# EAGLE design maus (EAGLE 9.6.2)

## Sheet 1 of 6
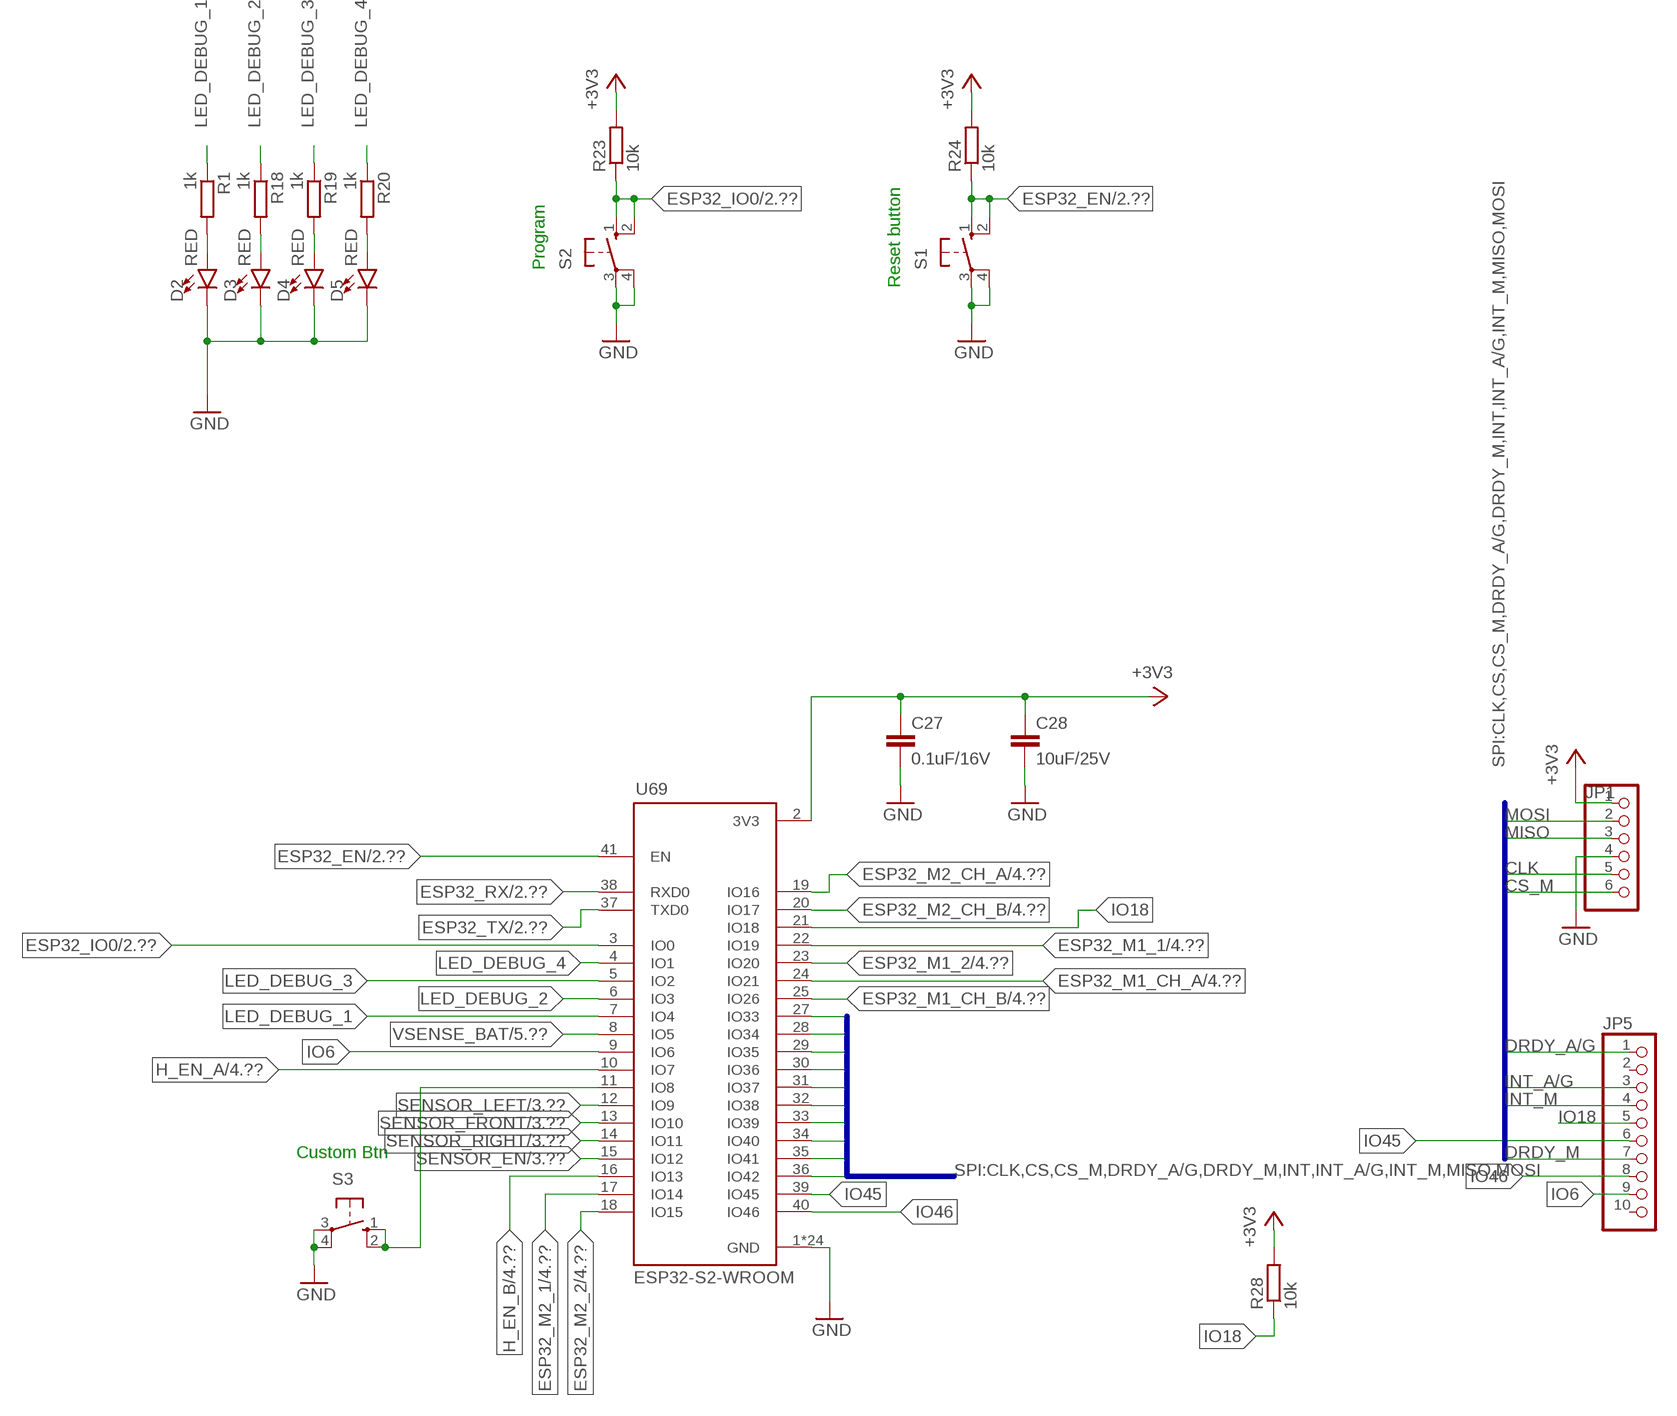
[diagram p0: schematic, sheet 1]

### Parts
C27  0.1uF/16V  C-EUC0805  [C0805]
C28  10uF/25V  C-EUC0805  [C0805]
D2  RED  LED-RED1206  [LED-1206]
D3  RED  LED-RED1206  [LED-1206]
D4  RED  LED-RED1206  [LED-1206]
D5  RED  LED-RED1206  [LED-1206]
JP1  PINHD-1X6  [1X06]
JP5  PINHD-1X10  [1X10]
R1  1k  R-EU_R0805  [R0805]
R18  1k  R-EU_R0805  [R0805]
R19  1k  R-EU_R0805  [R0805]
R20  1k  R-EU_R0805  [R0805]
R23  10k  R-EU_R0805  [R0805]
R24  10k  R-EU_R0805  [R0805]
R28  10k  R-EU_R0805  [R0805]
S1  10-XX  [B3F-10XX]
S2  10-XX  [B3F-10XX]
S3  10-XX  [B3F-10XX]
U69  ESP32-S2-WROOM  [XCVR_ESP32-S2-WROOM]

### Nets
+3V3 [power]: C27.1 C28.1 JP1.1 R23.2 R24.2 R28.2 U69.2(3V3) ; also sheet 2,4,5,6
CLK: JP1.5 U69.30(IO36) ; also sheet 6
CS: U69.28(IO34) ; also sheet 6
CS_M: JP1.6 U69.27(IO33)
DRDY_A/G: JP5.1 U69.36(IO42)
DRDY_M: JP5.7 U69.32(IO38)
ESP32_EN: R24.1 S1.1(S) S1.2(S1) U69.41(EN) ; also sheet 2
ESP32_IO0: R23.1 S2.1(S) S2.2(S1) U69.3(IO0) ; also sheet 2
ESP32_M1_1: U69.22(IO19) ; also sheet 4
ESP32_M1_2: U69.23(IO20) ; also sheet 4
ESP32_M1_CH_A: U69.24(IO21) ; also sheet 4
ESP32_M1_CH_B: U69.25(IO26) ; also sheet 4
ESP32_M2_1: U69.17(IO14) ; also sheet 4
ESP32_M2_2: U69.18(IO15) ; also sheet 4
ESP32_M2_CH_A: U69.19(IO16) ; also sheet 4
ESP32_M2_CH_B: U69.20(IO17) ; also sheet 4
ESP32_RX: U69.38(RXD0) ; also sheet 2
ESP32_TX: U69.37(TXD0) ; also sheet 2
GND [power]: C27.2 C28.2 D2.C D3.C D4.C D5.C JP1.4 S1.3(P) S1.4(P1) S2.3(P) S2.4(P1) S3.3(P) S3.4(P1) U69.1(GND) U69.26(GND) U69.42(GND) U69.43.1(GND) U69.43.2(GND) U69.43.3(GND) U69.43.4(GND) U69.43.5(GND) U69.43.6(GND) U69.43.7(GND) U69.43.8(GND) U69.43.9(GND) U69.43.10(GND) U69.43.11(GND) U69.43.12(GND) U69.43.13(GND) U69.43.14(GND) U69.43.15(GND) U69.43.16(GND) U69.43.17(GND) U69.43.18(GND) U69.43.19(GND) U69.43.20(GND) U69.43.21(GND) ; also sheet 2,3,4,5,6
H_EN_A: U69.10(IO7) ; also sheet 4
H_EN_B: U69.16(IO13) ; also sheet 4
INT: U69.33(IO39) ; also sheet 6
INT_A/G: JP5.3 U69.35(IO41)
INT_M: JP5.4 U69.34(IO40)
IO6: JP5.9 U69.9(IO6)
IO18: JP5.5 R28.1 U69.21(IO18)
IO45: JP5.6 U69.39(IO45)
IO46: JP5.8 U69.40(IO46)
LED_DEBUG_1: R1.1 U69.7(IO4)
LED_DEBUG_2: R18.1 U69.6(IO3)
LED_DEBUG_3: R19.1 U69.5(IO2)
LED_DEBUG_4: R20.1 U69.4(IO1)
MISO: JP1.3 U69.31(IO37) ; also sheet 6
MOSI: JP1.2 U69.29(IO35) ; also sheet 6
N$1: S3.1(S) S3.2(S1) U69.11(IO8)
N$23: D2.A R1.2
N$25: D3.A R18.2
N$26: D4.A R19.2
N$28: D5.A R20.2
SENSOR_EN: U69.15(IO12) ; also sheet 3
SENSOR_FRONT: U69.13(IO10) ; also sheet 3
SENSOR_LEFT: U69.12(IO9) ; also sheet 3
SENSOR_RIGHT: U69.14(IO11) ; also sheet 3
VSENSE_BAT: U69.8(IO5) ; also sheet 5
Unconnected: JP5.2 JP5.10

### Buses
SPI:CLK,CS,CS_M,DRDY_A/G,DRDY_M,INT,INT_A/G,INT_M,MISO,MOSI

### Notes on the sheet
- Program
- Reset button
- Custom Btn

## Sheet 2 of 6: UART/Prog
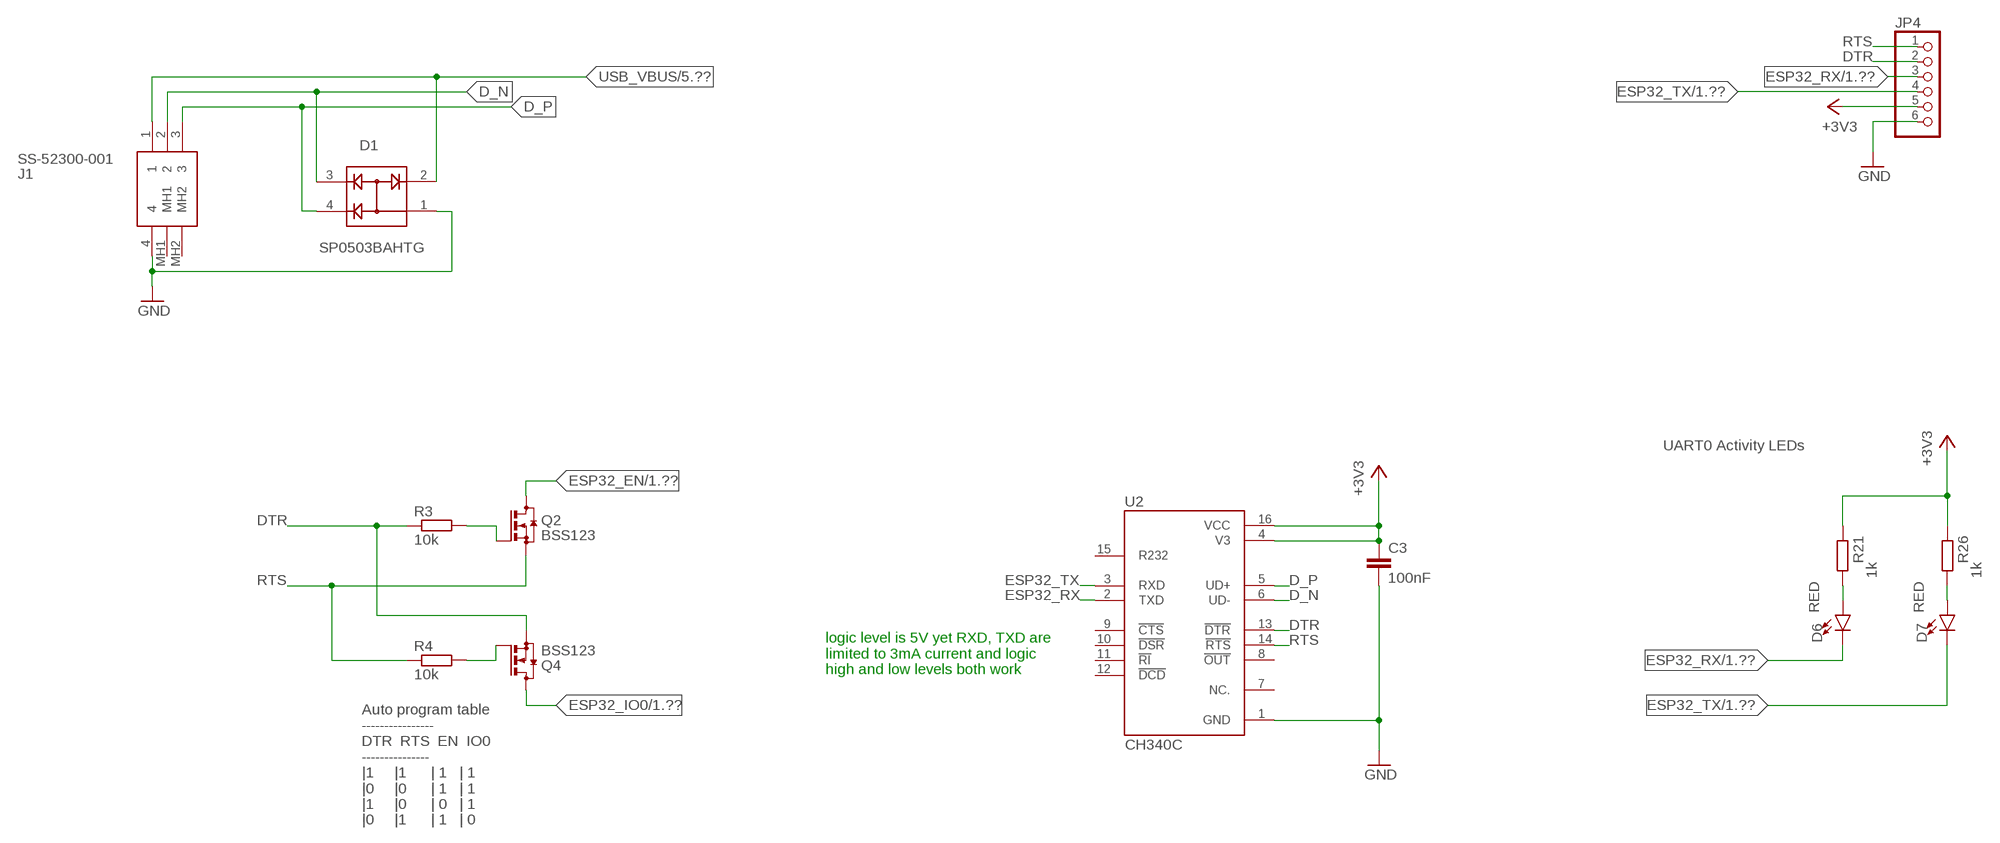
[diagram p1: schematic, sheet 2]

### Parts
C3  100nF  C-EUC0805  [C0805]
D1  SP0503BAHTG  [SOT143]
D6  RED  LED-RED1206  [LED-1206]
D7  RED  LED-RED1206  [LED-1206]
J1  SS-52300-001  [SS52300001]
JP4  PINHD-1X6  [1X06]
Q2  BSS123  [SOT23]
Q4  BSS123  [SOT23]
R3  10k  R-EU_R0805  [R0805]
R4  10k  R-EU_R0805  [R0805]
R21  1k  R-EU_R0805  [R0805]
R26  1k  R-EU_R0805  [R0805]
U2  CH340C  [SOIC127P600X180-16N]

### Nets
+3V3 [power]: C3.1 JP4.5 R21.2 R26.2 U2.4(V3) U2.16(VCC) ; also sheet 1,4,5,6
D_N: D1.3 J1.2 U2.6(UD-)
D_P: D1.4 J1.3 U2.5(UD+)
DTR: JP4.2 Q4.2(S) R3.1 U2.13(!DTR)
ESP32_EN: Q2.3(D) ; also sheet 1
ESP32_IO0: Q4.3(D) ; also sheet 1
ESP32_RX: D6.C JP4.3 U2.2(TXD) ; also sheet 1
ESP32_TX: D7.C JP4.4 U2.3(RXD) ; also sheet 1
GND [power]: C3.2 D1.1 J1.4 JP4.6 U2.1(GND) ; also sheet 1,3,4,5,6
N$5: Q2.1(G) R3.2
N$6: Q4.1(G) R4.2
N$8: D6.A R21.1
N$22: D7.A R26.1
RTS: JP4.1 Q2.2(S) R4.1 U2.14(!RTS)
USB_VBUS: D1.2 J1.1 ; also sheet 5
Unconnected: J1.MH1 J1.MH2 U2.7(NC.) U2.8(!OUT) U2.9(!CTS) U2.10(!DSR) U2.11(!RI) U2.12(!DCD) U2.15(R232)

### Notes on the sheet
- UART0 Activity LEDs
- logic level is 5V yet RXD, TXD are 
  limited to 3mA current and logic
  high and low levels both work
- Auto program table
  ----------------
  DTR  RTS  EN  IO0
  ---------------
  |1     |1      | 1   | 1
  |0     |0      | 1   | 1
  |1     |0      | 0   | 1
  |0     |1      | 1   | 0

## Sheet 3 of 6: IR
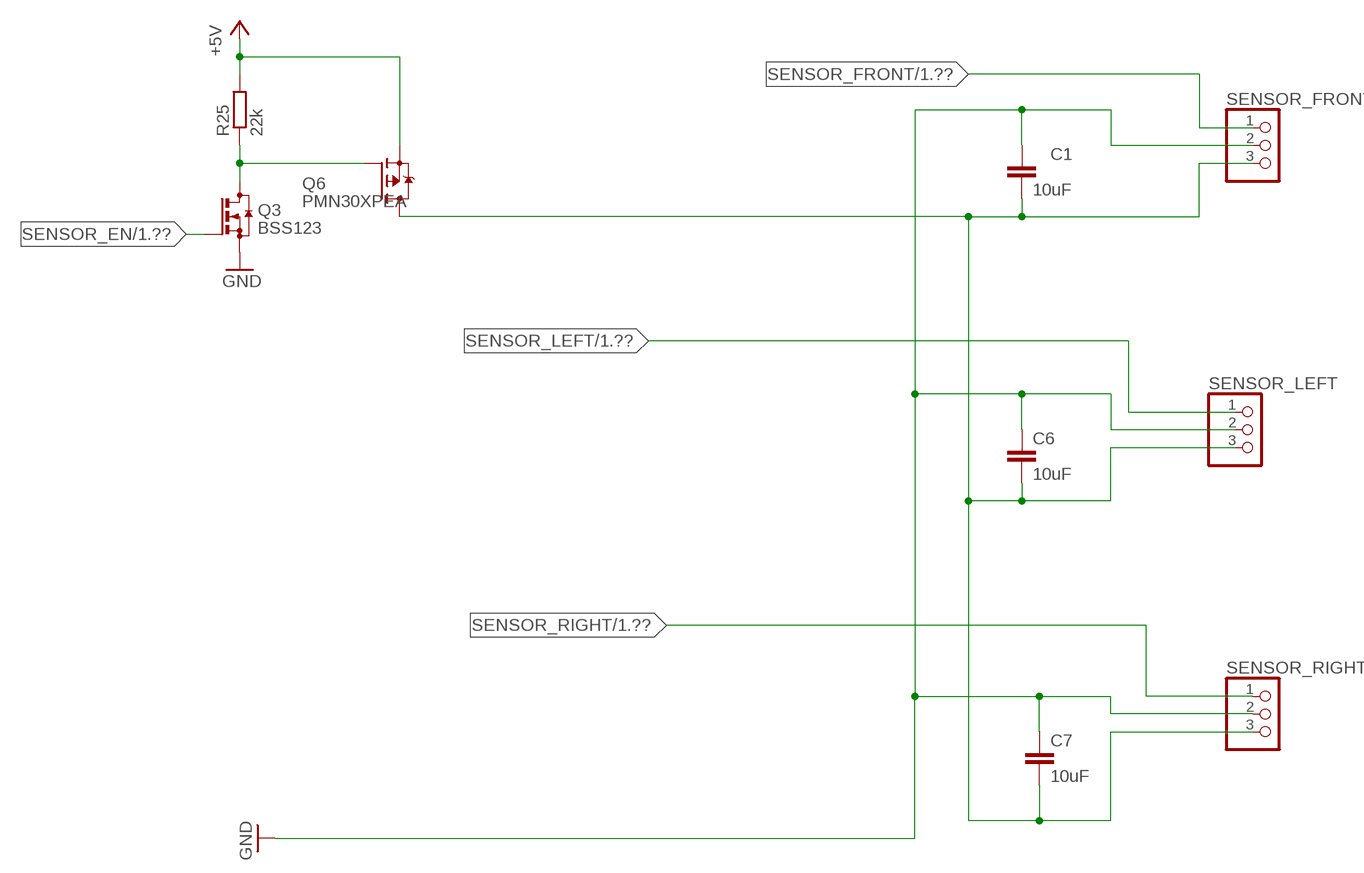
[diagram p2: schematic, sheet 3]

### Parts
C1  10uF  C-EUC0805  [C0805]
C6  10uF  C-EUC0805  [C0805]
C7  10uF  C-EUC0805  [C0805]
Q3  BSS123  [SOT23]
Q6  PMN30XPEA  [SOT95P255X110-6N]
R25  22k  R-EU_R0805  [R0805]
SENSOR_FRONT  PINHD-1X3  [1X03]
SENSOR_LEFT  PINHD-1X3  [1X03]
SENSOR_RIGHT  PINHD-1X3  [1X03]

### Nets
+5V [power]: Q6.4(S) R25.2 ; also sheet 4,5
GND [power]: C1.1 C6.1 C7.1 Q3.2(S) SENSOR_FRONT.2 SENSOR_LEFT.2 SENSOR_RIGHT.2 ; also sheet 1,2,4,5,6
N$2: Q3.3(D) Q6.3(G) R25.1
N$7: C1.2 C6.2 C7.2 Q6.1(D) Q6.2(D) Q6.5(D) Q6.6(D) SENSOR_FRONT.3 SENSOR_LEFT.3 SENSOR_RIGHT.3
SENSOR_EN: Q3.1(G) ; also sheet 1
SENSOR_FRONT: SENSOR_FRONT.1 ; also sheet 1
SENSOR_LEFT: SENSOR_LEFT.1 ; also sheet 1
SENSOR_RIGHT: SENSOR_RIGHT.1 ; also sheet 1

## Sheet 4 of 6: H-bridge motor driver
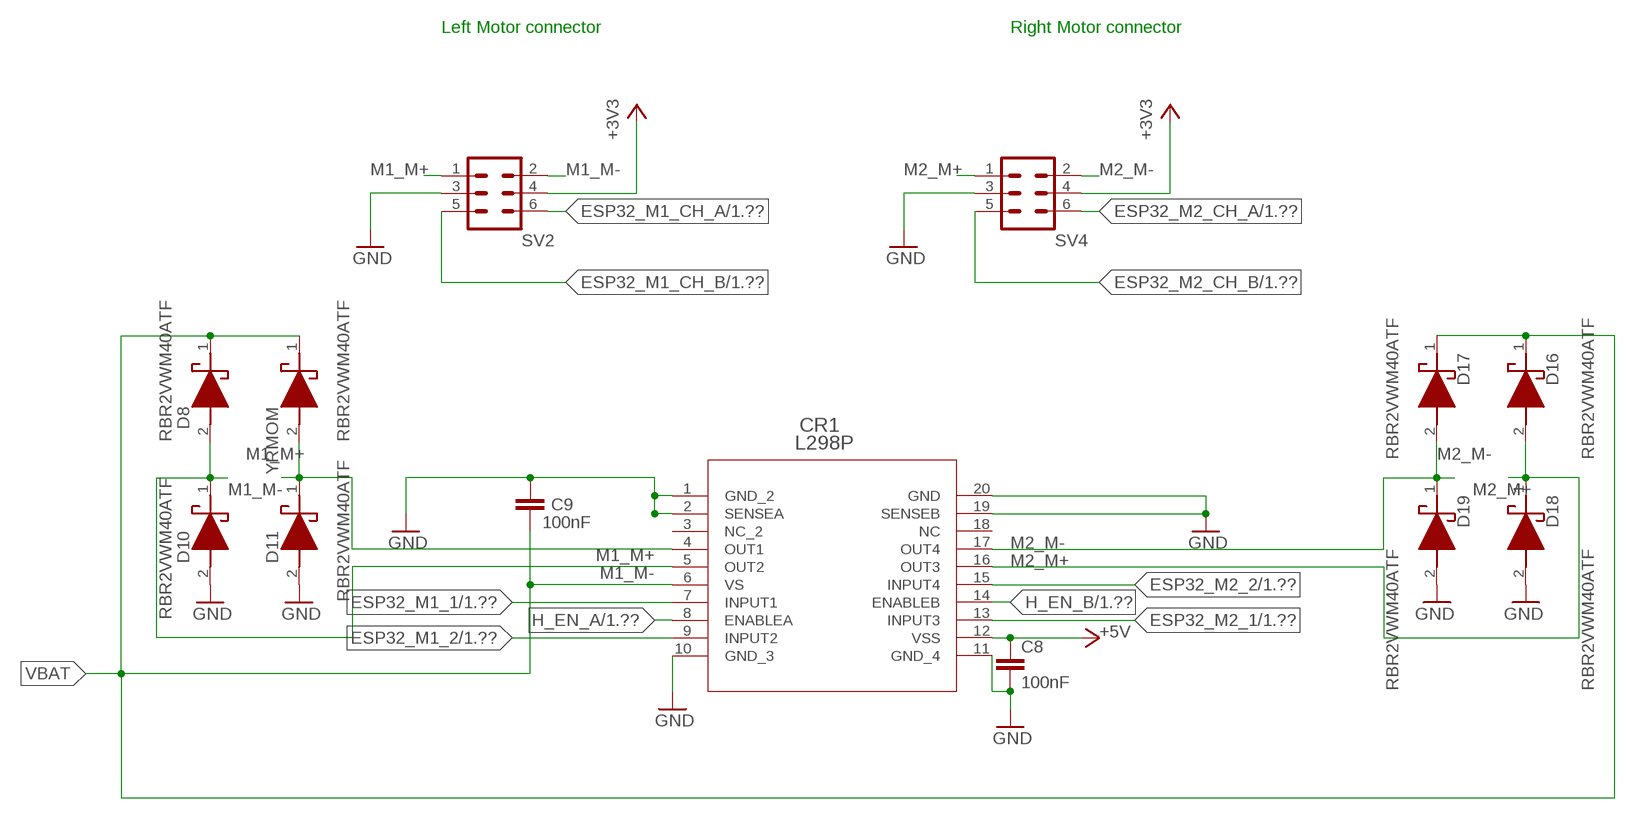
[diagram p3: schematic, sheet 4]

### Parts
C8  100nF  C-EUC0805  [C0805]
C9  100nF  C-EUC0805  [C0805]
CR1  L298P  [POWERSO-20_STM]
D8  RBR2VWM40ATF  [RB068VWM100]
D10  RBR2VWM40ATF  [RB068VWM100]
D11  RBR2VWM40ATF  [RB068VWM100]
D16  RBR2VWM40ATF  [RB068VWM100]
D17  RBR2VWM40ATF  [RB068VWM100]
D18  RBR2VWM40ATF  [RB068VWM100]
D19  RBR2VWM40ATF  [RB068VWM100]
SV2  ML6  [ML6]
SV4  ML6  [ML6]
YRMOM  RBR2VWM40ATF  [RB068VWM100]

### Nets
+3V3 [power]: SV2.4 SV4.4 ; also sheet 1,2,5,6
+5V [power]: C8.1 CR1.12(VSS) ; also sheet 3,5
ESP32_M1_1: CR1.7(INPUT1) ; also sheet 1
ESP32_M1_2: CR1.9(INPUT2) ; also sheet 1
ESP32_M1_CH_A: SV2.6 ; also sheet 1
ESP32_M1_CH_B: SV2.5 ; also sheet 1
ESP32_M2_1: CR1.13(INPUT3) ; also sheet 1
ESP32_M2_2: CR1.15(INPUT4) ; also sheet 1
ESP32_M2_CH_A: SV4.6 ; also sheet 1
ESP32_M2_CH_B: SV4.5 ; also sheet 1
GND [power]: C8.2 C9.2 CR1.1(GND_2) CR1.2(SENSEA) CR1.10(GND_3) CR1.11(GND_4) CR1.19(SENSEB) CR1.20(GND) D10.2(A) D11.2(A) D18.2(A) D19.2(A) SV2.3 SV4.3 ; also sheet 1,2,3,5,6
H_EN_A: CR1.8(ENABLEA) ; also sheet 1
H_EN_B: CR1.14(ENABLEB) ; also sheet 1
M1_M+ [motorpower]: CR1.4(OUT1) D11.1(K) SV2.1 YRMOM.2(A)
M1_M- [motorpower]: CR1.5(OUT2) D8.2(A) D10.1(K) SV2.2
M2_M+ [motorpower]: CR1.16(OUT3) D16.2(A) D18.1(K) SV4.1
M2_M- [motorpower]: CR1.17(OUT4) D17.2(A) D19.1(K) SV4.2
VBAT [power]: C9.1 CR1.6(VS) D8.1(K) D16.1(K) D17.1(K) YRMOM.1(K) ; also sheet 5
Unconnected: CR1.3(NC_2) CR1.18(NC)

### Notes on the sheet
- Left Motor connector | Right Motor connector

## Sheet 5 of 6: power
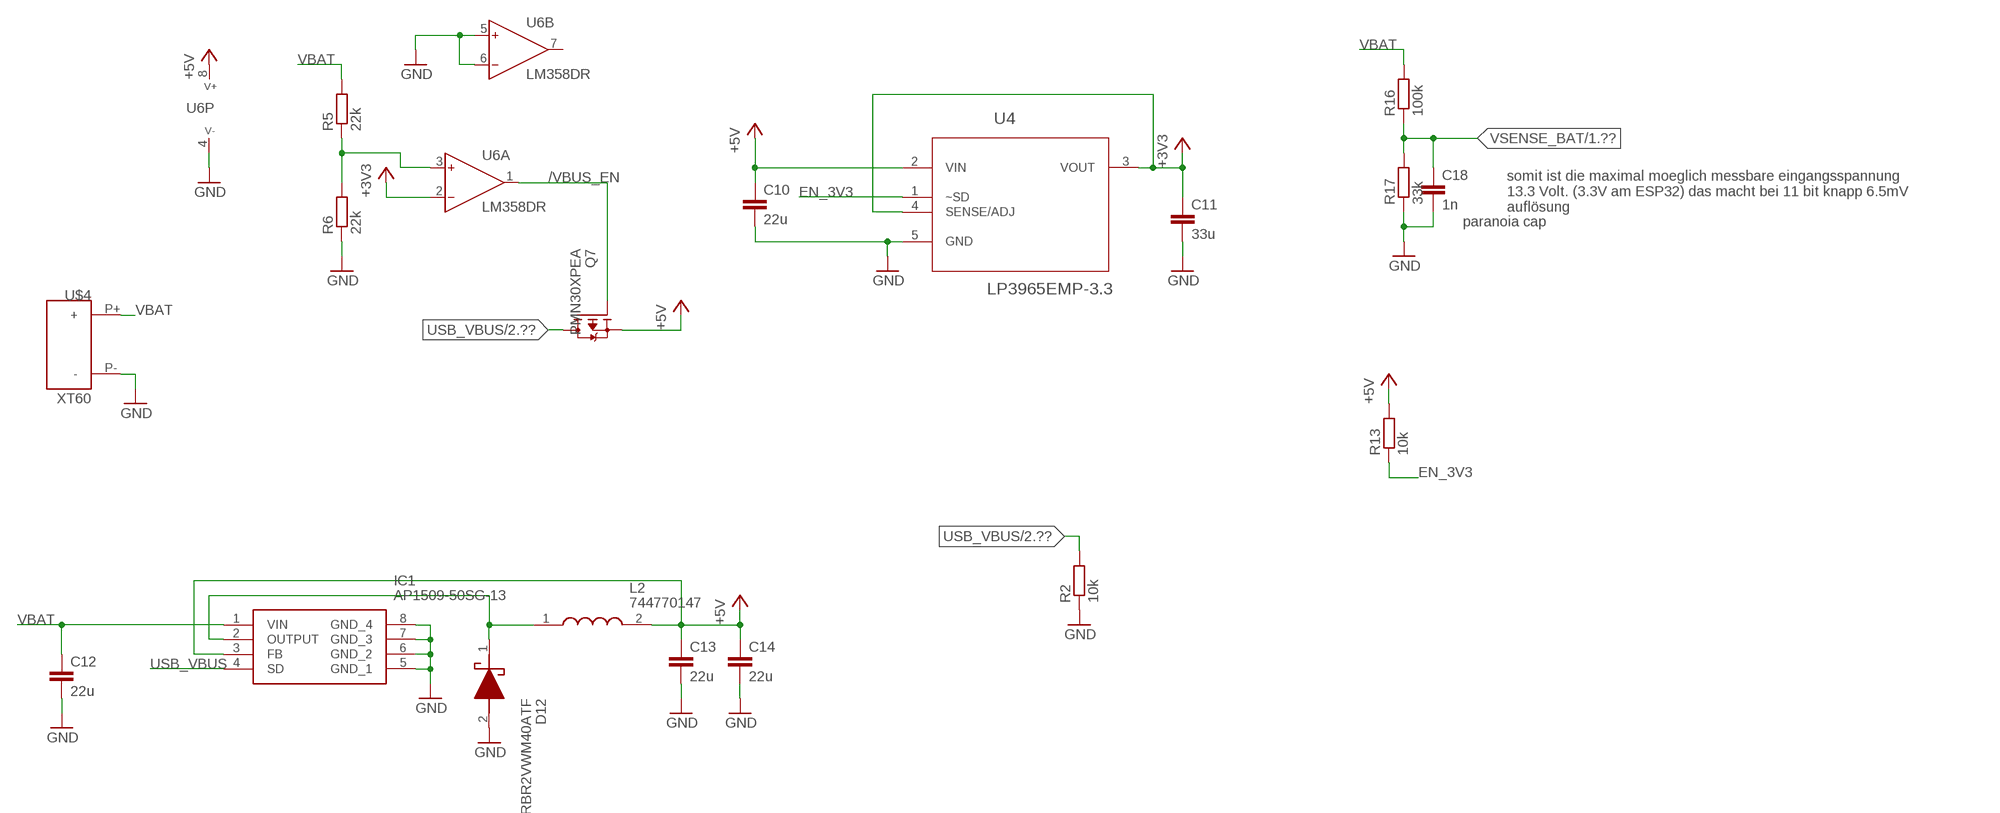
[diagram p4: schematic, sheet 5]

### Parts
C10  22u  C-EUC0805  [C0805]
C11  33u  C-EUC0805  [C0805]
C12  22u  C-EUC0805  [C0805]
C13  22u  C-EUC0805  [C0805]
C14  22u  C-EUC0805  [C0805]
C18  1n  C-EUC0805  [C0805]
D12  RBR2VWM40ATF  [RB068VWM100]
IC1  AP1509-50SG-13  [SOIC127P600X175-8N]
L2  744770147  [WE-PD_1260/1245/1280/121054]
Q7  PMN30XPEA  [SOT95P255X110-6N]
R2  10k  R-EU_R0805  [R0805]
R5  22k  R-EU_R0805  [R0805]
R6  22k  R-EU_R0805  [R0805]
R13  10k  R-EU_R0805  [R0805]
R16  100k  R-EU_R0805  [R0805]
R17  33k  R-EU_R0805  [R0805]
U4  LP3965EMP-3.3  [SOT150P696X180-5N]
U6  LM358DR  [SOIC127P610X175-8N]
U$4  XT60  [XT60-UPRIGHT]

### Nets
+3V3 [power]: C11.1 U4.3(VOUT) U4.4(SENSE/ADJ) U6.2(A:IN-) ; also sheet 1,2,4,6
+5V [power]: C10.1 C13.1 C14.1 IC1.3(FB) L2.2 Q7.4(S) R13.2 U4.2(VIN) U6.8(P:V+) ; also sheet 3,4
/VBUS_EN: Q7.3(G) U6.1(A:OUT)
EN_3V3: R13.1 U4.1(~SD)
GND [power]: C10.2 C11.2 C12.2 C13.2 C14.2 C18.2 D12.2(A) IC1.5(GND_1) IC1.6(GND_2) IC1.7(GND_3) IC1.8(GND_4) R2.1 R6.1 R17.1 U4.5(GND) U6.4(P:V-) U6.5(B:IN+) U6.6(B:IN-) U$4.P-(-) ; also sheet 1,2,3,4,6
N$3: D12.1(K) IC1.2(OUTPUT) L2.1
N$13: R5.1 R6.2 U6.3(A:IN+)
USB_VBUS: IC1.4(SD) Q7.1(D) Q7.2(D) Q7.5(D) Q7.6(D) R2.2 ; also sheet 2
VBAT [power]: C12.1 IC1.1(VIN) R5.2 R16.2 U$4.P+(+) ; also sheet 4
VSENSE_BAT: C18.1 R16.1 R17.2 ; also sheet 1
Unconnected: U6.7(B:OUT)

### Notes on the sheet
- somit ist die maximal moeglich messbare eingangsspannung
  13.3 Volt. (3.3V am ESP32) das macht bei 11 bit knapp 6.5mV
  auflösung
- paranoia cap

## Sheet 6 of 6: navigation
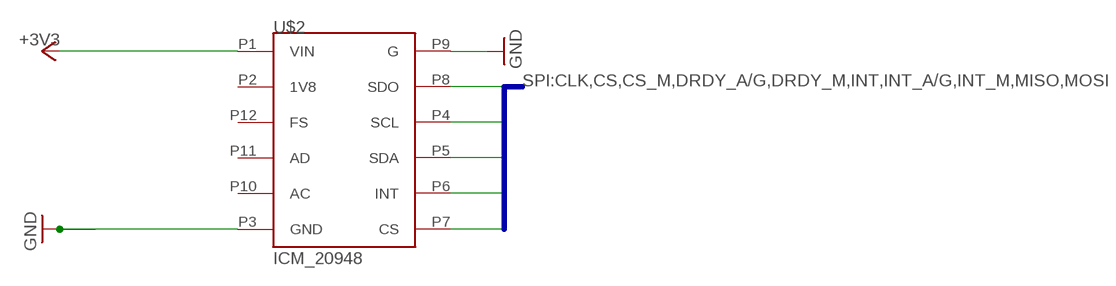
[diagram p5: schematic, sheet 6]

### Parts
U$2  ICM_20948  [ICM_20948-F]

### Nets
+3V3 [power]: U$2.P1(VIN) ; also sheet 1,2,4,5
CLK: U$2.P4(SCL) ; also sheet 1
CS: U$2.P7(CS) ; also sheet 1
GND [power]: U$2.P3(GND) U$2.P9(G) ; also sheet 1,2,3,4,5
INT: U$2.P6(INT) ; also sheet 1
MISO: U$2.P8(SDO) ; also sheet 1
MOSI: U$2.P5(SDA) ; also sheet 1
Unconnected: U$2.P2(1V8) U$2.P10(AC) U$2.P11(AD) U$2.P12(FS)

### Buses
SPI:CLK,CS,CS_M,DRDY_A/G,DRDY_M,INT,INT_A/G,INT_M,MISO,MOSI

## Library data of the parts
C1 C3 C6-C14 C18 C27 C28 = rcl:C-EU: CAPACITOR, European symbol; SPICEPREFIX: C
CR1 = maus:L298P; COPYRIGHT: Copyright (C) 2022 Ultra Librarian. All rights reserved.; MANUFACTURER_PART_NUMBER: L298P; MFR_NAME: STMicroelectronics
D1 = maus:SP0503BAHTG: TVS DIODE 5.5VWM 8.5VC SOT143 Check availability <https://pricing.snapeda.com/parts/SP0503BAHTG/Littelfuse%20Inc./view-part?ref=eda>; AVAILABILITY: In Stock; DESCRIPTION: 8.5V Clamp - Ipp Tvs Diode Surface Mount SOT-143-4; MF: Littelfuse Inc.; MP: SP0503BAHTG; PACKAGE: None; PRICE: None; PURCHASE-URL: https://pricing.snapeda.com/search/part/SP0503BAHTG/?ref=eda
D2-D7 = SparkFun-LED:LED-RED: Red SMD LED Used in manufacturing of most products at SparkFun Packages: 0603 - SMD 0603 package [Product Link] <http://docs.avagotech.com/docs/AV02-0551EN> 0603 SMART - SMD 0603 SMART package ( more efficient and expensive)[Product Link] <http://www.osram-os.com/Graphics/XPic2/00077099_0.pdf> 1206 - SMD1206 package [Product Link] <https://www.sparkfun.com/datasheets/DevTools/LilyPad/Q150OVS4.pdff> SparkFun Products: Pro Mini 328 -5V <https://www.sparkfun.com/products/821> RedBoard <https://www.sparkfun.com/products/12757> IOIO-OTG <https://www.sparkfun.com/products/13613>; PROD_ID: DIO-09912
D8 D10-D12 D16-D19 YRMOM = maus:RBR2VWM40ATF: Low VF, 40V, 2A, Schottky Barrier Diode for Automoive Source: Datasheet <https://fscdn.rohm.com/en/products/databook/datasheet/discrete/diode/schottky_barrier/rbr2vwm40atftr-e.pdf>; DESCRIPTION: Low V<sub>F</sub>, 40V, 2A, Schottky Barrier Diode for Automoive; HEIGHT: 0.95mm; MANUFACTURER_NAME: ROHM Semiconductor; MANUFACTURER_PART_NUMBER: RBR2VWM40ATF
IC1 = maus:AP1509-50SG-13: DiodesZetex, AP1509-50SG-13 DC-DC Converter 2A 8-Pin, SOP Source: Datasheet <https://www.diodes.com/assets/Datasheets/AP1509.pdf>; ARROW_PART_NUMBER: AP1509-50SG-13; ARROW_PRICE-STOCK: https://www.arrow.com/en/products/ap1509-50sg-13/diodes-incorporated?region=nac; DESCRIPTION: DiodesZetex, AP1509-50SG-13 DC-DC Converter 2A 8-Pin, SOP; HEIGHT: 1.75mm; MANUFACTURER_NAME: Diodes Inc.; MANUFACTURER_PART_NUMBER: AP1509-50SG-13; MOUSER_PART_NUMBER: 621-AP1509-50SG-13; MOUSER_PRICE-STOCK: https://www.mouser.co.uk/ProductDetail/Diodes-Incorporated/AP1509-50SG-13?qs=EJYhozv%252BYpwbI10CpTvwPw%3D%3D
J1 = maus:SS-52300-001: USB Connectors USB 2.0 RA Receptacle Type B Source: Datasheet <https://belfuse.com/resources/datasheets/stewartconnector/ds-stw-usb-2.0-type-b-connectors.pdf>; DESCRIPTION: USB Connectors USB 2.0 RA Receptacle Type B; HEIGHT: 10.82mm; MANUFACTURER_NAME: Bel; MANUFACTURER_PART_NUMBER: SS-52300-001; MOUSER_PART_NUMBER: 530-SS-52300-001
JP1 JP4 = maus:PINHD-1X6: PIN HEADER
JP5 = maus:PINHD-1X10: PIN HEADER
L2 = maus:744770147: SMD-Shielded Power Inductors WE-PD Source: Datasheet; DESCRIPTION: SMD-Shielded Power Inductors WE-PD; HEIGHT: mm; MANUFACTURER_NAME: Wurth Elektronik; MANUFACTURER_PART_NUMBER: 744770147; MOUSER_PART_NUMBER: 710-744770147; MOUSER_PRICE-STOCK: https://www.mouser.co.uk/ProductDetail/Wurth-Elektronik/744770147?qs=E%2F%2FhvbtCqpOiGvqyq%252BELzg%3D%3D
Q2-Q4 = transistor-small-signal:BSS123: N-CHANNEL MOS FET
Q6 Q7 = maus:PMN30XPEA
R1-R6 R13 R16-R21 R23-R26 R28 = rcl:R-EU_: RESISTOR, European symbol; SPICEPREFIX: R
S1-S3 = switch-omron:10-XX: OMRON SWITCH; MPN: B3F-1000; OC_FARNELL: 176432; OC_NEWARK: 36M3542
SENSOR_FRONT SENSOR_LEFT SENSOR_RIGHT = maus:PINHD-1X3: PIN HEADER
SV2 SV4 = con-harting-ml:ML6: HARTING; OC_FARNELL: unknown; OC_NEWARK: unknown
U2 = maus:CH340C: USB to serial chip CH340 Check availability <https://pricing.snapeda.com/parts/CH340C/WCH/view-part?ref=eda>; AVAILABILITY: Not in stock; DESCRIPTION: USB to serial chip CH340; MF: WCH; MP: CH340C; PACKAGE: None; PRICE: None
U4 = maus:LP3965EMP-3.3: Fast Ultra Low Dropout Linear Regulators Check availability <https://pricing.snapeda.com/parts/LP3965EMP-3.3/NOPB/Texas%20Instruments/view-part?ref=eda>; AVAILABILITY: In Stock; DESCRIPTION: 1.5-A, low-dropout voltage regulator with sense & enable 5-SOT-223 -40 to 125; MF: Texas Instruments; MP: LP3965EMP-3.3/NOPB; PACKAGE: SOT-223-5 Texas Instruments; PRICE: None; PURCHASE-URL: https://pricing.snapeda.com/search/part/LP3965EMP-3.3/NOPB/?ref=eda
U6 = maus:LM358DR: LM358DR dual op-amp
U69 = maus:ESP32-S2-WROOM: WiFi 802.11b/g/n Transceiver Module 2.4GHz PCB Trace Surface Mount Check availability <https://pricing.snapeda.com/parts/ESP32-S2-WROOM/Espressif%20Systems/view-part?ref=eda>; AVAILABILITY: In Stock; DESCRIPTION: WiFi 802.11b/g/n Transceiver Module 2.4GHz Antenna Not Included, I-PEX Surface Mount; MF: Espressif Systems; MP: ESP32-S2-WROOM; PACKAGE: VFQFN-56 Espressif Systems; PRICE: None; PURCHASE-URL: https://pricing.snapeda.com/search/part/ESP32-S2-WROOM/?ref=eda
U$2 = maus:ICM_20948: The ICM20948 from Invensense packs 9 Degrees of freedom into a teeny package, making it a one stop shop for all the DOFs you need! Within it’s svelte 3x3mm package there are not just one MEMS sensor die like your common sensors, but two sensor dies!
U$4 = maus:XT60

## Net classes
0 default: width 0.127 mm, clearance 0.254 mm
1 power: width 0.508 mm, clearance 0.254 mm
2 motorpower: width 0.508 mm

## Board
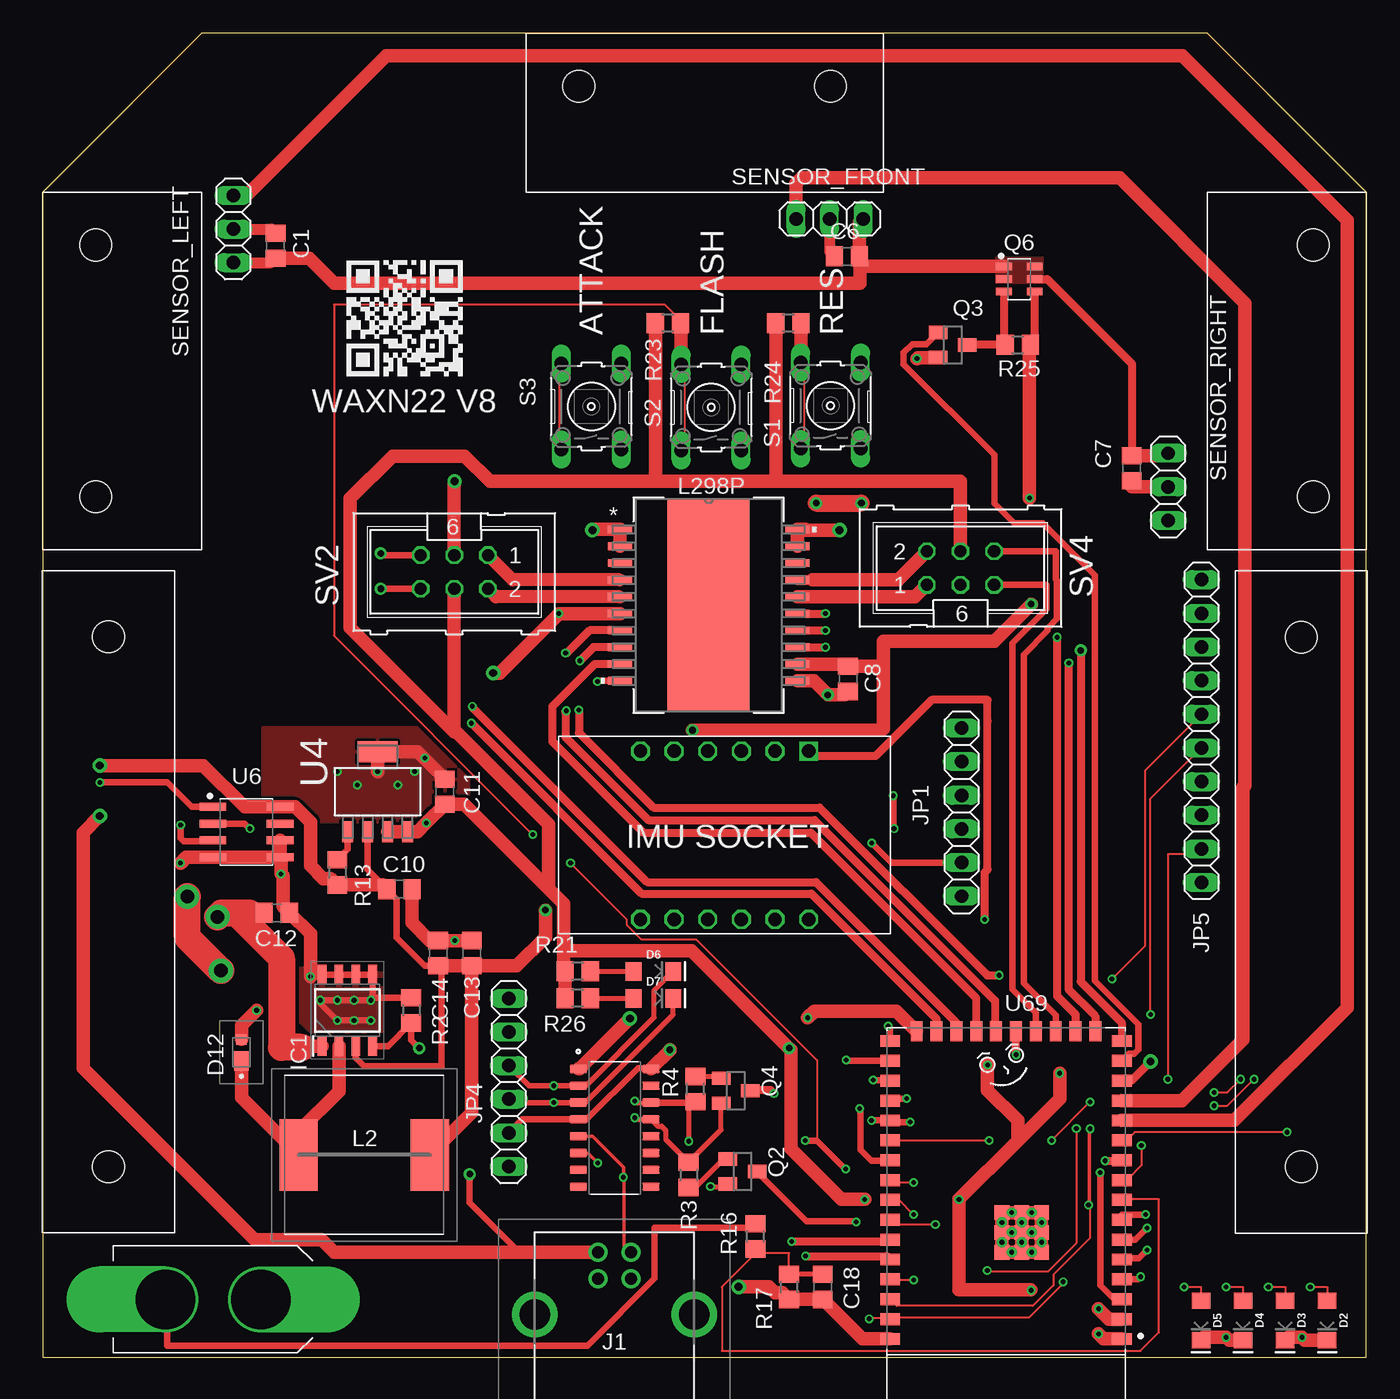
[diagram p6: board, top side]
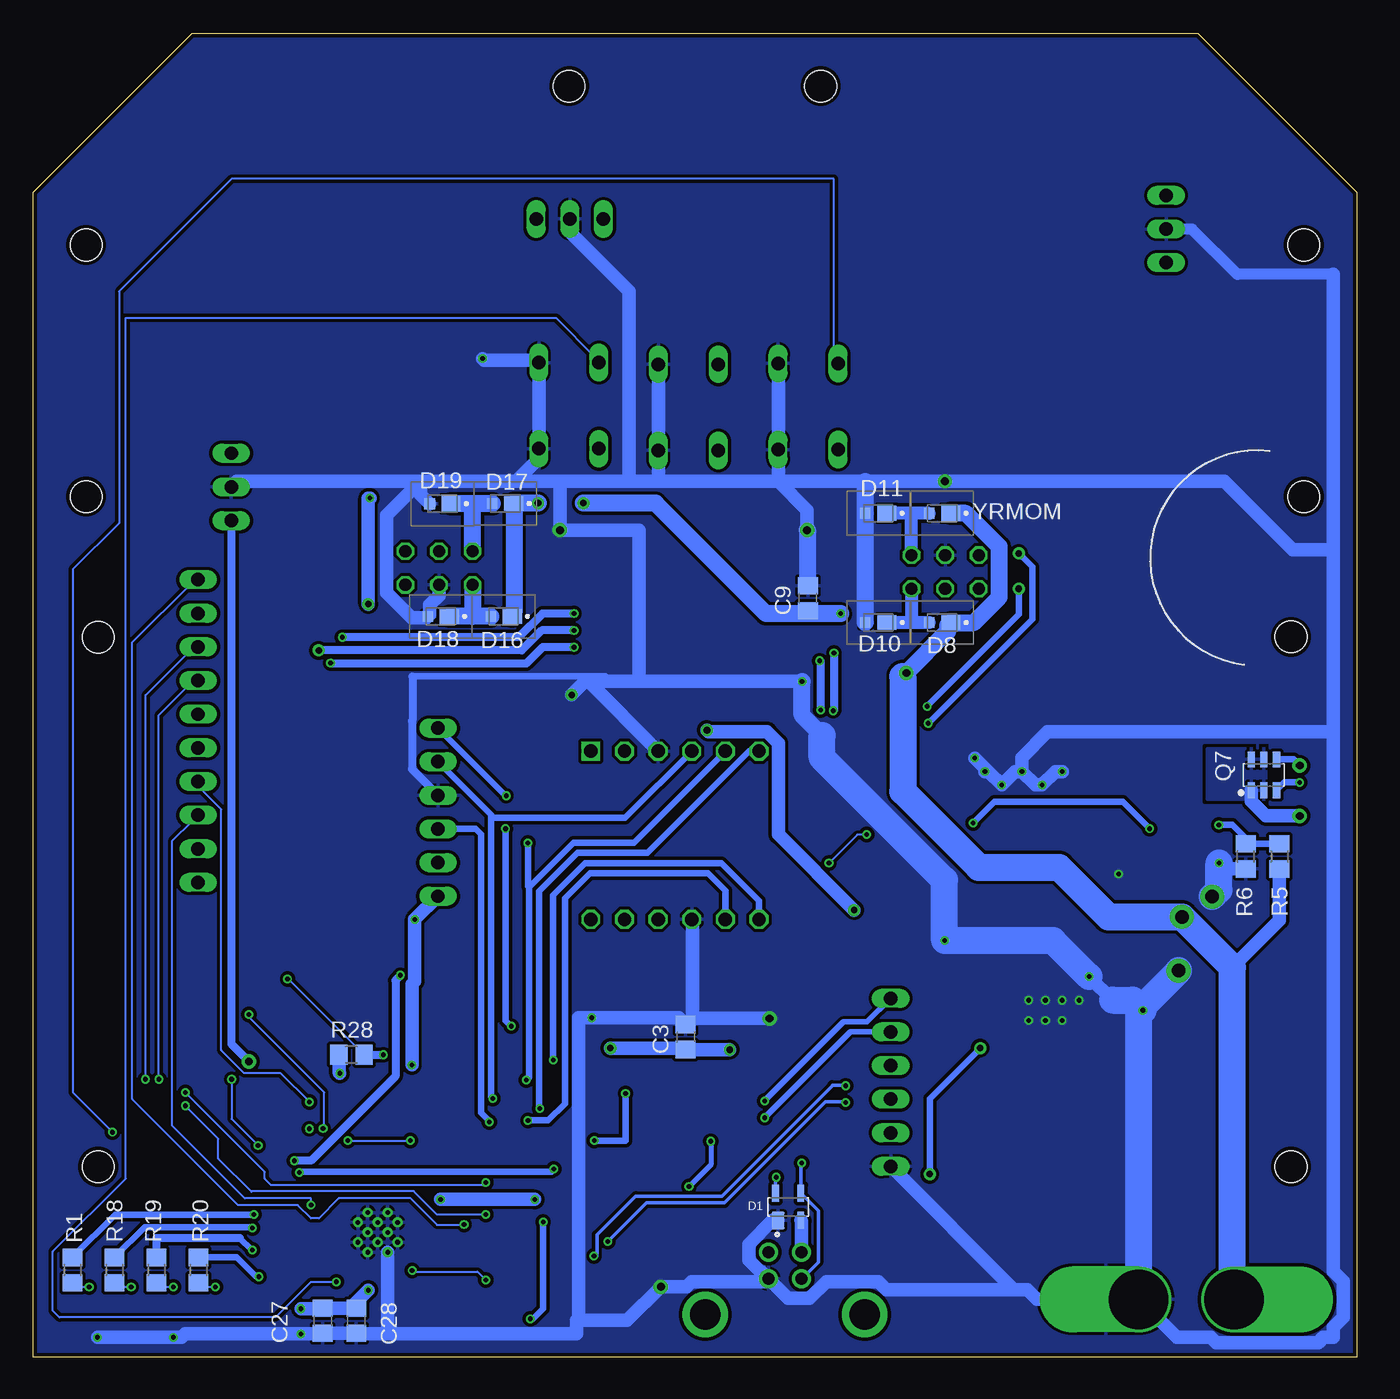
[diagram p7: board, bottom side, seen from below]

Size 100 x 100 mm. Coordinates in mm from the lower left corner, seen from the top.
Outline: 0,0 100,0 100,88 88,100 12,100 0,88 0,0
Copper layers (1*16): Top 0.035mm / dielectric 1.5mm / Bottom 0.035mm
Design rules "PCB-POOL Standard": minimum track width 0.15mm, minimum drill 0.3mm, track to track 0.15mm, track to pad 0.15mm, pad to pad 0.15mm, via to via 0.15mm, smd to smd 0.15mm, copper to edge 0.3mm, drill to drill 0.2mm, minimum pad ring 0.2mm, minimum via ring 0.15mm, stop-mask expansion 0.03mm, vias tented up to drill 0mil, thermal gap 0.2mm

### Footprints (pad centres in the part's own frame; a part is rotated, then mirrored left to right if it is on the bottom)
C0805 = smd 1.3 x 1.5: 1 -0.95,0; 2 0.95,0
POWERSO-20_STM = smd 1.803 x 0.584: 1 -6.706,5.715; 2 -6.706,4.445; 3 -6.706,3.175; 4 -6.706,1.905; 5 -6.706,0.635; 6 -6.706,-0.635; 7 -6.706,-1.905; 8 -6.706,-3.175; 9 -6.706,-4.445; 10 -6.706,-5.715; 11 6.706,-5.715; 12 6.706,-4.445; 13 6.706,-3.175; 14 6.706,-1.905; 15 6.706,-0.635; 16 6.706,0.635; 17 6.706,1.905; 18 6.706,3.175; 19 6.706,4.445; 20 6.706,5.715 | smd 6.198 x 16.002: EPAD 0,0
SOT143 = smd 0.99 x 1.3: 1 -0.76,-1.025 | smd 0.59 x 1.3: 2 0.96,-1.025; 3 0.96,1.025; 4 -0.96,1.025
LED-1206 = smd 1.2 x 1.4: A -1.5,0; C 1.5,0
RB068VWM100 = smd 1.1 x 1.45: 1 0,-0.65 | smd 0.8 x 0.8: 2 0,0.975
SOIC127P600X175-8N = smd 1.5 x 0.65: 1 -2.7,1.905; 2 -2.7,0.635; 3 -2.7,-0.635; 4 -2.7,-1.905; 5 2.7,-1.905; 6 2.7,-0.635; 7 2.7,0.635; 8 2.7,1.905
SS52300001 = drill 0.92 pad 1.431: 1 0,0; 2 0,-2; 3 2.5,0; 4 2.5,-2 | drill 2.3 pad 3.45: MH1 -4.77,-4.71; MH2 7.27,-4.71
1X06 = drill 1.016 long: 1 -6.35,0; 2 -3.81,0; 3 -1.27,0; 4 1.27,0; 5 3.81,0; 6 6.35,0
1X10 = drill 1.016 long: 1 -11.43,0; 2 -8.89,0; 3 -6.35,0; 4 -3.81,0; 5 -1.27,0; 6 1.27,0; 7 3.81,0; 8 6.35,0; 9 8.89,0; 10 11.43,0
WE-PD_1260/1245/1280/121054 = smd 2.9 x 5.4: 1 -4.95,0; 2 4.95,0
SOT23 = smd 1 x 1.4: 1 -0.95,-1.1; 2 0.95,-1.1; 3 0,1.1
SOT95P255X110-6N = smd 1.187 x 0.547: 1 -1.163,0.95; 2 -1.163,0; 3 -1.163,-0.95; 4 1.163,-0.95; 5 1.163,0; 6 1.163,0.95
R0805 = smd 1.3 x 1.5: 1 -0.95,0; 2 0.95,0
B3F-10XX = drill 1.016 long: 1 -3.251,2.261; 2 3.251,2.261; 3 -3.251,-2.261; 4 3.251,-2.261
1X03 = drill 1.016 long: 1 -2.54,0; 2 0,0; 3 2.54,0
ML6 = drill 0.914 octagon: 1 -2.54,-1.27; 2 -2.54,1.27; 3 0,-1.27; 4 0,1.27; 5 2.54,-1.27; 6 2.54,1.27
SOIC127P600X180-16N = smd 1.31 x 0.62: 1 -2.75,4.445; 2 -2.75,3.175; 3 -2.75,1.905; 4 -2.75,0.635; 5 -2.75,-0.635; 6 -2.75,-1.905; 7 -2.75,-3.175; 8 -2.75,-4.445; 9 2.75,-4.445; 10 2.75,-3.175; 11 2.75,-1.905; 12 2.75,-0.635; 13 2.75,0.635; 14 2.75,1.905; 15 2.75,3.175; 16 2.75,4.445
SOT150P696X180-5N = smd 1.6 x 0.838: 1 -3.023,2.261; 2 -3.023,0.762; 3 -3.023,-0.762; 4 -3.023,-2.261 | smd 1.6 x 2.997: 5 3.023,0
SOIC127P610X175-8N = smd 2.035 x 0.599: 1 -2.538,1.905; 2 -2.538,0.635; 3 -2.538,-0.635; 4 -2.538,-1.905; 5 2.538,-1.905; 6 2.538,-0.635; 7 2.538,0.635; 8 2.538,1.905
XCVR_ESP32-S2-WROOM = smd 1.5 x 0.9: 1 -8.75,8; 2 -8.75,6.5; 3 -8.75,5; 4 -8.75,3.5; 5 -8.75,2; 6 -8.75,0.5; 7 -8.75,-1; 8 -8.75,-2.5; 9 -8.75,-4; 10 -8.75,-5.5; 11 -8.75,-7; 12 -8.75,-8.5; 13 -8.75,-10; 14 -8.75,-11.5; 15 -8.75,-13; 16 -8.75,-14.5; 27 8.75,-14.5; 28 8.75,-13; 29 8.75,-11.5; 30 8.75,-10; 31 8.75,-8.5; 32 8.75,-7; 33 8.75,-5.5; 34 8.75,-4; 35 8.75,-2.5; 36 8.75,-1; 37 8.75,0.5; 38 8.75,2; 39 8.75,3.5; 40 8.75,5; 41 8.75,6.5; 42 8.75,8 | smd 0.9 x 1.5: 17 -6.75,-15.25; 18 -5.25,-15.25; 19 -3.75,-15.25; 20 -2.25,-15.25; 21 -0.75,-15.25; 22 0.75,-15.25; 23 2.25,-15.25; 24 3.75,-15.25; 25 5.25,-15.25; 26 6.75,-15.25 | smd 1.1 x 1.1: 43.1 -1.19,-0.05; 43.2 -2.69,-0.05; 43.3 0.31,-0.05; 43.4 -2.69,-1.55; 43.5 -1.19,-1.55; 43.6 0.31,-1.55; 43.7 -2.69,1.45; 43.8 -1.19,1.45; 43.9 0.31,1.45 | drill 0.35 pad 0.406: 43.10 -1.19,0.7; 43.11 -2.69,0.7; 43.12 0.31,0.7; 43.13 -2.69,-0.8; 43.14 -1.19,-0.8; 43.15 0.31,-0.8; 43.16 -1.94,1.45; 43.17 -0.44,1.45; 43.18 -1.94,-0.05; 43.19 -0.44,-0.05; 43.20 -1.94,-1.55; 43.21 -0.44,-1.55
MOTOR_HALTERUNG = hole 2.4: 5,5; 45,5
ICM_20948-F = drill 1.016 square: P1 -6.35,6.35 | drill 1.016 octagon: P2 -6.35,3.81; P3 -6.35,1.27; P4 -6.35,-1.27; P5 -6.35,-3.81; P6 -6.35,-6.35; P7 6.35,-6.35; P8 6.35,-3.81; P9 6.35,-1.27; P10 6.35,1.27; P11 6.35,3.81; P12 6.35,6.35
XT60-UPRIGHT = drill 4.5 pad 5 offset: P+ 3.6,0; P- -3.6,0
SENSOR_HALTERUNG = hole 2.4: 4,4; 23,4

### Placement (x,y rotation side)
C1  17.6,83.95 270 top
C3  50.71,24.19 90 bottom
C6  60.75,83.14 0 top
C7  82.26,67.14 90 top
C8  60.83,51.23 270 top
C9  41.47,57.33 90 bottom
C10  26.96,35.35 0 top
C11  30.39,42.71 90 top
C12  17.69,33.57 0 top
C13  32.42,30.52 90 top
C14  29.88,30.52 90 top
C18  58.93,5.32 270 top
C27  78.12,2.76 270 bottom
C28  75.58,2.76 270 bottom
CR1  50.31,56.8 0 top
D1  42.96,11.36 0 bottom
D2  97.03,2.78 270 top
D3  93.86,2.78 270 top
D4  90.68,2.78 270 top
D5  87.5,2.78 270 top
D6  46.13,29.14 0 top
D7  46.13,27.11 0 top
D8  31.32,55.48 90 bottom
D10  36.15,55.48 90 bottom
D11  36.15,63.74 90 bottom
D12  15.02,23.03 0 top
D16  64.45,55.95 90 bottom
D17  64.33,64.48 90 bottom
D18  69.2,55.95 90 bottom
D19  69.07,64.46 90 bottom
IC1  23.02,26.2 90 top
J1  41.94,7.93 0 top
JP1  69.41,41.17 90 top
JP4  35.21,20.76 270 top
JP5  87.54,47.29 270 top
L2  24.29,15.28 0 top
Q2  52.87,14.03 270 top
Q3  68.75,76.44 270 top
Q4  52.36,20.13 270 top
Q6  73.77,81.43 0 top
Q7  7.02,43.98 90 bottom
R1  97.03,6.59 270 bottom
R2  27.85,26.2 270 top
R3  48.8,13.78 270 top
R4  49.31,20.25 90 top
R5  5.84,37.83 270 bottom
R6  8.38,37.83 90 bottom
R13  22.26,36.62 270 top
R16  53.85,9.13 90 top
R17  56.39,5.32 90 top
R18  93.86,6.59 270 bottom
R19  90.68,6.59 270 bottom
R20  87.5,6.59 270 bottom
R21  40.42,29.14 180 top
R23  47.23,78.09 180 top
R24  56.33,78.09 180 top
R25  73.66,76.46 0 top
R26  40.42,27.11 180 top
R28  75.95,22.85 180 bottom
S1  59.52,71.87 90 top
S2  50.5,71.74 90 top
S3  41.45,71.8 90 top
SENSOR_FRONT  59.45,85.97 0 top
SENSOR_LEFT  14.41,85.21 270 top
SENSOR_RIGHT  85.03,65.73 90 top
SV2  31.1,59.31 180 top
SV4  69.34,59.6 0 top
U2  43.21,17.33 0 top
U4  25.31,42.71 90 top
U6  15.4,39.67 0 top
U69  72.77,9.38 180 top
U$1  [MOTOR_HALTERUNG]  -0.03,59.4 270 top
U$2  51.51,39.43 270 top
U$3  [MOTOR_HALTERUNG]  100.08,9.38 90 top
U$4  12.88,4.38 180 top
U$6  [SENSOR_HALTERUNG]  100,61 90 top
U$7  [SENSOR_HALTERUNG]  63.5,100 180 top
U$8  [SENSOR_HALTERUNG]  0,88 270 top
YRMOM  31.32,63.74 90 bottom

### Tracks (layer width: path | path; a pad name or v marks a point on that pad's centre or on a via)
+3V3  (via drill 0.35, 0.5)
  Top 0.508: v15.65,39.92 15.27,40.3 U6.2 | U2.16 45.91,21.83 44.96,21.83 41.1,17.97 U2.4 36.23,17.97 JP4.5 | v74.68,5.07 74.65,5.1 | R21.2 39.5,29 39.34,29
  Top 0.61: v71.16,33.06 71.16,36.61 71.39,36.83 71.39,48.04 71.38,48.05 71.38,49.64 67.17,49.64 62.93,45.4 58.24,45.4 U$2.P1
  Top 1.016: U4.3 U4.4 28.31,39.69 v28.98,40.35 C11.1 31.84,41.76 38.23,35.38 | 38.23,35.38 39.34,34.27 39.34,30.72 | U69.2 80.54,2.88 v79.76,3.67 | SV2.4 31.1,47.38 | 31.1,47.38 31.1,47.25 23.24,55.1 23.24,64.88 26.42,68.06 31.88,68.06 33.78,66.15 46.48,66.15 | 31.1,47.38 38.23,40.24 38.23,35.38 | 55.37,66.15 69.34,66.15 SV4.4 | 39.34,30.72 39.34,29 | v62.11,11.92 60.33,11.92 56.52,15.73 56.52,23.23 v56.39,23.35 49.02,30.72 39.34,30.72 | U2.16 47.37,23.19 v47.37,23.23 | R21.2 R26.2 | 73.66,16.37 v69.22,11.92 69.22,5.1 74.65,5.1 | v76.84,21.45 76.84,19.53 73.66,16.35 73.66,16.37 | 73.66,16.37 73.66,17.89 71.38,20.18 v71.38,22.08 | R24.2 55.38,66.16 55.37,66.15 | 55.37,66.15 46.48,66.15 | R23.2 46.28,66.36 46.48,66.15
  Bottom 0.508: 75.58,4.16 C28.1 | v15.65,39.92 17.69,41.95 27.38,41.95 v28.98,40.35
  Bottom 1.016: v74.68,5.07 75.58,4.16 | v79.76,3.67 78.17,3.67 C27.1 C28.1 | v47.37,23.23 47.39,23.24 C3.1 50.82,23.35 v56.39,23.35 | v62.11,11.92 v69.22,11.92 | v76.84,21.45 76.9,21.51 R28.2 | v71.38,22.08 71.38,28.19 71.16,28.4 v71.16,33.06 JP1.1
+5V  (via drill 0.35, 0.5, 0.6)
  Top 0.508: 30.12,29.33 30.12,21.99 24.28,21.99 23.66,22.62 IC1.3 | U4.2 24.54,36.81 C10.1 26.75,34.61 26.75,31.69 28.86,29.57 C14.1
  Top 0.61: Q6.4 74.93,76.78 74.55,76.4
  Top 1.016: 30.12,29.33 C14.1 C13.1 | L2.2 32.42,18.46 C13.1 | C10.1 25.69,35.67 R13.2 21.77,36.16 21.19,36.16 20.23,37.12 20.23,40.41 19.06,41.57 U6.8 15.26,41.57 12.14,44.69 v4.32,44.69 | C13.1 35.81,29.57 37.98,31.74 v37.98,33.77 | CR1.12 60.66,52.36 C8.1 63.5,52.18 | 63.5,52.18 63.5,47.48 63.38,47.36 v49.09,47.36 | 63.5,52.18 63.5,54.08 71.88,54.08 v74.68,56.88 | v74.55,64.88 74.55,76.4 R25.2
  Bottom 0.508: Q7.4 4.78,45.15 v4.32,44.69
  Bottom 1.016: v74.68,56.88 74.68,64.88 v74.55,64.88 | v37.98,33.77 43.69,39.48 43.69,46.39 44.55,47.25 48.98,47.25 v49.09,47.36
/VBUS_EN  (via drill 0.35)
  Top 0.508: v4.32,43.42 9.4,43.42 11.25,41.57 U6.1
  Bottom 0.508: Q7.3 5.47,43.42 v4.32,43.42
CLK  (via drill 0.35)
  Top 0.508: U69.30 64.18,19.54 v65.28,19.54
  Bottom 0.508: JP1.5 65.41,40.98 65.41,40.75 | U$2.P4 55.27,40.75 65.41,40.75 | v65.28,19.54 65.41,19.67 65.41,40.75
CS  (via drill 0.35)
  Top 0.508: v60.71,22.47 60.79,22.38 U69.28
  Bottom 0.508: U$2.P7 45.16,34.48 48.01,37.32 58.3,37.32 60.71,34.91 v60.71,22.47
CS_M  (via drill 0.35)
  Top 0.15: 64,23.9 U69.27
  Top 0.508: v64.26,42.4 64.26,39.97 v64.31,39.92 | v63.88,25.01 64,24.88 64,23.9
  Bottom 0.508: v64.26,42.4 64.3,42.4 JP1.6 | v64.31,39.92 64.31,25.43 v63.88,25.01
D_N  (via drill 0.35)
  Top 0.254: v41.94,14.66 41.18,15.43 U2.6
  Bottom 0.254: v41.94,14.66 42,14.61 D1.3 40.67,11.06 40.67,7.17 41.91,5.93
  Bottom 0.381: 41.91,5.93 J1.2
D_P  (via drill 0.35)
  Top 0.152: v43.87,13.59 43.94,13.59
  Top 0.254: U2.5 41.53,16.7 43.87,14.36 v43.87,13.59 | 43.94,13.59 43.94,8.44 J1.3
  Bottom 0.254: v43.87,13.59 43.92,13.55 D1.4
DRDY_A/G  (via drill 0.35)
  Top 0.152: v67.44,10.02 67.42,10 64.4,10 U69.36
  Bottom 0.15: v67.44,10.02 69.48,10.02 69.48,10.01 71.48,12 76.91,12 78.41,10.5 79,10.5 80,11.5 84.5,11.5 92.5,19.5 92.5,54 88,58.5 JP5.1
DRDY_M  (via drill 0.35)
  Top 0.152: v76.21,16.36 v76.2,16.37 v79.12,19.29 | v71.5,16.37 64.04,16.37 U69.32
  Bottom 0.152: v76.21,16.36 v71.51,16.36 v71.5,16.37 | JP5.7 87.54,43.12 85.79,41.37 85.79,23.2 84.06,21.47 81.3,21.47 v79.12,19.29
DTR  (via drill 0.35)
  Top 0.381: Q4.2 51.26,17.18 R3.1 47.06,16.46 47.06,17.15 46.76,17.45 46.48,17.45 U2.13 44.87,17.97 v44.74,18.09
  Bottom 0.406: v44.74,18.09 38.26,24.57 JP4.2
EN_3V3
  Top 0.508: R13.1 23.05,38.35 U4.1
ESP32_EN  (via drill 0.35)
  Top 0.15: v77.09,5.7 77.09,5.57 74.55,3.03 74.5,3 64.5,3 U69.41 64,3 62.5,3 v62.45,2.91 | S1.1 57.5,69 57.5,75 S1.2
  Top 0.508: Q2.3 57.72,10.28 61.41,10.28 v61.47,10.23
  Top 1.016: R24.1 57.28,75.14 S1.2
  Bottom 0.15: 79.76,4.94 81.66,3.03 98,3.03 98,3 98.5,3.5 98.5,8 93,13.5 93,78.5 60.5,78.5 57.5,75.5 S1.2
  Bottom 0.152: 79.76,4.94 79,5.7 v77.09,5.7
  Bottom 0.508: v61.47,10.23 61.47,3.67 62.23,2.91 v62.45,2.91
ESP32_IO0  (via drill 0.35)
  Top 0.15: 81.03,4.3 U69.3 | v37.02,39.48 22,54.5 22,79.5 47,79.5 48,78.5 R23.1 | S2.1 48.5,68.5 48.5,74.5 S2.2
  Top 0.152: Q4.3 53.46,20.18 | v39.88,37.32 44.12,33.08 44.12,32.65 45.21,31.56 49.37,31.56 58.49,22.44 58.49,16.37
  Top 0.508: 81.03,4.3 79.89,5.45 v79.89,13.96 | v60.65,14.21 58.49,16.37 v57.6,16.37
  Top 0.61: v55.25,19.92 54.99,20.18 53.97,20.18 53.46,20.18
  Top 1.016: R23.1 48.24,78.03 S2.2
  Bottom 0.152: v37.02,39.48 37.73,39.48 v39.88,37.32
  Bottom 0.254: v60.65,14.21 60.83,14.03
  Bottom 0.508: 60.83,14.03 75.13,14.03 79.81,14.03 v79.89,13.96 | v55.25,19.92 55.25,16.37 v57.6,16.37
ESP32_M1_1  (via drill 0.35)
  Top 0.15: U69.22 72,24.5 71.94,24.62
  Top 0.61: v39.5,53.2 39.63,53.2 41.32,54.89 CR1.7 | v39.55,48.83 39.5,48.77 39.5,46.84 45.77,40.57 58.31,40.57 71.94,26.94 71.94,24.62
  Bottom 0.61: v39.5,53.2 39.5,48.88 v39.55,48.83
ESP32_M1_2
  Top 0.61: CR1.9 41.7,52.36 38.48,49.14 38.48,46.52 45.38,39.62 58.03,39.62 70.52,27.13 U69.23
ESP32_M1_CH_A  (via drill 0.35, 0.5)
  Top 0.508: SV2.6 v25.54,58.04
  Top 0.61: v32.45,49.16 32.45,49.1 45.66,35.88 58.42,35.88 69.02,25.28 U69.24
  Bottom 0.508: v25.54,58.04 25.54,56.11 32.47,49.18 v32.45,49.16
ESP32_M1_CH_B  (via drill 0.35, 0.5)
  Top 0.508: v25.54,60.7 25.4,60.56 28.55,60.56
  Top 0.61: v32.39,47.88 45.26,35.01 58.07,35.01 67.52,25.56 U69.25
  Top 0.813: SV2.5 28.55,60.56
  Bottom 0.508: v25.54,60.7 24.53,59.69 24.53,55.73 32.37,47.88 v32.39,47.88
ESP32_M2_1  (via drill 0.35)
  Top 0.61: CR1.13 v59.14,53.62 | v77.52,52.44 77.49,52.41 77.49,27.81 79.52,25.78 U69.17
  Bottom 0.61: v59.14,53.62 61.5,53.62 62.72,52.4 77.48,52.4 v77.52,52.44
ESP32_M2_2  (via drill 0.35)
  Top 0.61: CR1.15 v59.14,56.17 | v76.64,54.38 76.63,54.36 76.63,27.3 78.02,25.9 U69.18
  Bottom 0.61: v59.14,56.17 61.53,56.17 63.31,54.38 v76.64,54.38
ESP32_M2_CH_A
  Top 0.508: SV4.6 76.53,60.87 76.53,58.77 76.63,58.67 76.63,55.78 75.89,55.04 75.89,54.85 74.11,53.07 74.11,28.24 76.52,25.83 U69.19
ESP32_M2_CH_B
  Top 0.508: SV4.5 75.82,58.33 75.82,56.5 73.25,53.92 73.25,27.81 75.02,26.03 U69.20
ESP32_RX  (via drill 0.35)
  Top 0.381: U2.2 41.03,20.51 46.19,25.66 46.19,27.7 D6.C
  Top 0.406: JP4.3 36.74,20.51 v38.61,20.51 U2.2
  Top 0.61: v57.63,7.64 63.77,7.64 U69.38
  Bottom 0.254: v57.63,7.64 57.41,7.64 57.41,9.26 54.48,12.18 47.96,12.18 39.63,20.52 39.63,20.56 38.61,20.56 v38.61,20.51
ESP32_TX  (via drill 0.35)
  Top 0.381: D7.C 47.63,25.88 40.99,19.24 U2.3
  Top 0.406: U2.3 v38.61,19.24 35.47,19.24 JP4.4
  Top 0.61: v56.57,8.76 63.9,8.76 U69.37
  Bottom 0.254: v56.57,8.76 53.66,11.67 47.75,11.67 40.13,19.29 38.66,19.29 v38.61,19.24
GND  (via drill 0.35, 0.5, 0.6, 1.02)
  Top 0.508: 20.39,28.9 IC1.8 IC1.7 IC1.6 IC1.5 24.92,27.09 v24.8,26.97 | v24.8,26.97 24.99,27.15 R2.1 | v24.8,26.97 v23.53,26.97 v22.26,26.97 v20.99,26.97 20.99,26.71 v22.26,25.44 v23.53,25.44 v24.8,25.44 | v41.91,51.04 41.96,51.08 CR1.10
  Top 0.813: C1.1 17.29,85.21 SENSOR_LEFT.2 | SENSOR_FRONT.2 59.45,83.5 C6.1
  Top 1.016: D12.2 15.02,25.06 v16.16,26.2 | 20.39,28.9 v20.23,28.74 20.23,31.98 C12.2 18.15,34.06 18.15,36.35 v18,36.5 18,37.7 U6.5 | C11.2 28.31,45.74 U4.5 v25.31,44.24 | U6.6 U6.5 | U6.5 U6.4 10.85,37.76 v10.42,37.32 | C13.2 v31.15,31.47 C14.2 29.24,31.47 27.91,32.81 C10.2 | U2.1 40.55,21.78 v44.36,25.59 | v60.2,62.47 57.66,62.47 57.61,62.52 CR1.20 CR1.19 | CR1.2 CR1.1 41.58,62.52 v41.53,62.47 | v52.58,5.32 54.86,5.32 55.32,4.86 55.9,4.86 R17.1 C18.2 61.92,1.38 U69.42 | U69.43.5 U69.43.21 U69.43.6 U69.43.15 U69.43.3 | U69.43.5 U69.43.20 U69.43.4 U69.43.13 U69.43.2 | U69.43.2 U69.43.18 U69.43.1 | U69.43.1 U69.43.14 U69.43.5 | U69.43.3 U69.43.19 U69.43.1 | U69.43.1 U69.43.10 U69.43.8 | U69.43.2 U69.43.11 U69.43.7 U69.43.16 U69.43.8 | U69.43.8 U69.43.17 U69.43.9 U69.43.12 U69.43.3 | U69.1 80.14,1.38 v79.76,1.76 | D5.C 87.73,1.51 v89.41,1.51 89.64,1.28 D4.C | D3.C 94.08,1.51 v95.12,1.51 95.36,1.28 D2.C | C8.2 60.58,50.02 v59.31,50.02 58.25,51.08 CR1.11 | v57.79,25.64 58.3,26.15 64.51,26.15 U69.26 | SENSOR_RIGHT.2 82.27,65.73 C7.1 | Q3.2 66.11,75.49 v66.04,75.42 | SV2.3 31.1,66.13 v31.12,66.15
  Top 2.032: v13.46,29.2 10.92,31.74 v10.92,34.78
  Bottom 0.508: 71.33,51.42 56.77,51.42 56.39,51.04
  Bottom 0.61: 71.33,51.42 71.33,48.09 71.39,48.04 71.39,44.41 JP1.4
  Bottom 0.813: 1.78,81.77 9.02,81.77 12.45,85.21 SENSOR_LEFT.2
  Bottom 1.016: 18.45,26.97 v20.23,28.74 | D1.1 44.13,10.34 45.92,8.55 45.92,7.32 45.06,6.46 44.97,6.46 J1.4 | JP4.6 25.89,5.09 | 1.78,47.23 1.78,6.5 1.01,5.73 1.01,3.03 1.78,2.26 1.78,1.51 2.53,1.51 2.93,1.12 10.63,1.12 11.02,1.51 13.61,1.51 U$4.P- 24.16,4.38 24.87,5.09 25.89,5.09 | 1.78,47.23 1.78,60.99 4.83,60.99 9.99,66.15 v31.12,66.15 37.12,66.15 43.69,66.15 | 1.78,61.11 1.78,81.77 | 43.7,66.15 41.53,63.98 v41.53,62.47 | 43.69,66.15 43.7,66.15 | 43.7,66.15 52.76,66.15 | 54.99,66.15 60.2,66.15 | 60.2,66.15 63.5,66.15 | 63.5,66.15 70.74,66.15 | 25.89,5.09 35.52,5.09 36.14,5.71 40.08,5.71 41.33,4.46 42.97,4.46 J1.4 | J1.4 44.67,5.71 50.24,5.71 50.64,5.32 v52.58,5.32 55.12,2.78 58.8,2.78 | 58.8,2.78 58.93,2.78 58.93,1.76 72.77,1.76 | 72.77,1.76 75.53,1.76 C28.2 C27.2 78.17,1.76 v79.76,1.76 88.52,1.76 88.78,1.51 v89.41,1.51 v95.12,1.51 | 1.78,47.23 23.37,47.23 25.31,45.29 v25.31,44.24 | v22.26,44.24 22.77,44.24 v23.78,43.22 24.29,43.22 v25.31,44.24 | v25.31,44.24 25.81,44.24 v26.83,43.22 27.85,44.24 v28.1,44.24 28.1,44.49 v28.86,45.25 | U69.43.17 73.21,2.2 72.77,1.76 | U$2.P9 50.19,33.02 50.19,25.59 | 58.8,2.78 58.8,25.64 v57.79,25.64 51.21,25.64 C3.2 50.26,25.59 50.19,25.59 | 54.36,51.04 54.23,51.17 54.23,62.47 v60.2,62.47 60.2,66.15 | 54.36,51.04 56.39,51.04 58.04,51.04 | 58.04,51.04 58.3,51.04 v59.31,50.02 | 54.36,51.04 v41.91,51.04 | 58.04,51.04 U$2.P3 | 70.74,66.15 70.74,65.15 D19.2 | 70.74,66.15 73.3,63.59 73.3,57.74 71.42,55.87 70.26,55.87 D18.2 70.04,56.09 70.04,56.82 69.34,57.52 SV4.3 | v44.36,25.59 50.19,25.59 | 43.69,66.15 43.69,68.53 S3.3 43.69,68.57 43.69,75.03 S3.4 | 52.76,66.15 S2.3 S2.4
  Bottom 1.016: SENSOR_FRONT.2 59.45,84.98 54.99,80.52 54.99,66.15 | 52.76,66.15 54.99,66.15 | 70.74,66.15 84.61,66.15 SENSOR_RIGHT.2 | v66.04,75.42 65.92,75.3 61.96,75.3 S1.4 S1.3 61.78,67.88 63.5,66.15 | R6.1 9.97,36.88 v10.42,37.32
  Bottom 1.27: C9.2 41.47,62.41 v41.53,62.47 | D10.2 D11.2 37.12,66.15 | 40.39,46.98 41.91,48.5 v41.91,51.04
  Bottom 2.032: 18.45,26.97 16.92,26.97 v16.16,26.2 16.48,26.52 | U$4.P- 16.48,26.52 | v20.23,28.74 22.95,31.47 v31.15,31.47 31.15,36.04 40.39,45.28 40.39,46.98 | 16.48,26.52 16.14,26.52 v13.46,29.2 | v10.92,34.78 10.42,35.29 v10.42,37.32
  pour Top: 20.23,24.68 25.56,24.68 25.56,29.25 18.96,29.25 18.96,25.95
  pour Top: 16.67,47.54 16.67,40.43 32.16,40.43 32.16,47.03 31.66,47.54
  pour Bottom (rank 3): 100.2,-0.39 100.2,88.14 88.14,100.2 11.94,100.2 -0.12,88.14 -0.12,-0.39
H_EN_A  (via drill 0.35)
  Top 0.61: CR1.8 41.61,53.62 v40.58,52.6 | v80.27,14.84 81.48,14.84 U69.10 | v40.51,48.88 v40.52,48.87 40.52,47.16 46.16,41.52 58.7,41.52 71.36,28.85 v72.25,28.85
  Bottom 0.61: v80.27,14.84 79,14.84 72.63,21.21 72.63,28.47 v72.25,28.85 | v40.58,52.6 40.52,52.6 v40.52,48.88 v40.51,48.88
H_EN_B  (via drill 0.35, 0.5)
  Top 0.61: CR1.14 v59.14,54.89 | v78.42,53.39 78.42,28.37 81.52,25.27 U69.16
  Bottom 0.61: v59.14,54.89 61.58,54.89 63.08,53.39 v78.42,53.39
INT  (via drill 0.35)
  Top 0.508: v61.72,18.78 61.78,18.73 61.78,15.68 62.61,14.84 63.98,14.84 U69.33
  Bottom 0.508: U$2.P6 45.91,45.78 53.58,38.1 58.87,38.1 61.78,35.2 61.78,18.84 v61.72,18.78
INT_A/G  (via drill 0.35)
  Top 0.15: v65.79,10.78 64.64,11.93 U69.35 | v91.5,21 89.5,19 v88.5,19
  Bottom 0.15: v65.79,10.78 69.47,10.78 | v91.5,21 91.5,50 88,53.5 JP5.3 | v88.5,19 86,16.5 86,15 83.5,12.5 83.5,12.56
  Bottom 0.152: 69.47,10.78 71.25,12.56 83.5,12.56
INT_M  (via drill 0.35)
  Top 0.15: v65.79,13.19 64.21,13.19 U69.34 | v90.5,21 89.5,20 v88.5,20
  Bottom 0.15: v90.5,21 90.5,48.5 88,51 JP5.4 | v88.5,20 82.5,14 82.5,13.5 82,13 66,13 v65.79,13.19
IO6  (via drill 0.35)
  Top 0.15: v83,16 83,14.5 82,13.5 U69.9 | v85,21 85,38 87.5,38 JP5.9
  Bottom 0.15: v83,16 85,18 v85,21
IO18  (via drill 0.35)
  Top 0.152: v80.77,28.56 83.29,31.08 83.29,44.33 87.52,48.56 JP5.5
  Top 0.61: v73.53,22.85 v73.52,22.85 U69.21
  Bottom 0.152: R28.1 80.71,28.56 v80.77,28.56
  Bottom 0.61: R28.1 v73.53,22.85
IO45  (via drill 0.35)
  Top 0.152: v78.09,17.28 78.09,8.6 75.95,6.46 71.45,6.46 v71.36,6.55 | v65.79,5.83 64.08,5.83 U69.39 | v83.69,25.89 83.69,42.18 JP5.6
  Bottom 0.15: 82,24 78,20 78,17.5 v78.09,17.28
  Bottom 0.152: v71.36,6.55 71.28,6.46 66.42,6.46 v65.79,5.83 | 82,24 83.69,25.7 v83.69,25.89
IO46  (via drill 0.35)
  Top 0.15: v79,11.5 79,17 v79.12,17.26
  Top 0.152: v79.12,17.26 79.12,9 76.36,6.24 76.36,5.44 74.8,3.88 64.53,3.88 U69.40
  Bottom 0.15: v79,11.5 79,12 84,12 89.5,17.5 89.5,39 88,40.5 JP5.8
LED_DEBUG_1  (via drill 0.35)
  Top 0.508: U69.7 81.52,10.78 v83.31,10.78
  Bottom 0.508: v83.31,10.78 93.79,10.78 R1.1
LED_DEBUG_2  (via drill 0.35)
  Top 0.508: U69.6 82.56,8.88 v83.44,9.77
  Bottom 0.508: R18.1 91.58,9.81 83.49,9.81 v83.44,9.77
LED_DEBUG_3  (via drill 0.35)
  Top 0.508: U69.5 81.62,7.48 82.81,7.48 v83.44,8.11
  Bottom 0.508: v83.44,8.11 83.5,8.11 84.38,9
  Bottom 0.61: R19.1 90.68,9 84.38,9
LED_DEBUG_4  (via drill 0.35)
  Top 0.508: U69.4 82.74,5.88 v82.93,6.08
  Bottom 0.508: v82.93,6.08 83,6.15 83.22,6.15 84.61,7.54 R20.1
M1_M+
  Top 1: CR1.4 35.51,58.7 SV2.1
  Bottom 1: YRMOM.2 33.66,63.74 | 33.66,63.74 D11.1 | SV2.1 33.66,60.6 33.66,63.74
M1_M-
  Top 1: SV2.2 34.24,57.44 CR1.5
  Bottom 1: D8.2 33.78,55.48 | 33.78,55.48 D10.1 | SV2.2 33.64,55.63 33.78,55.48
M2_M+
  Top 1.016: SV4.1 65.91,57.44 CR1.16
  Bottom 1.27: D16.2 66.8,55.95 | 66.8,55.95 D18.1 | 66.8,55.95 66.8,55.96 SV4.1
M2_M-
  Top 0.762: CR1.17 58.14,58.7
  Top 1.016: 58.14,58.7 64.64,58.7 SV4.2
  Bottom 1.27: D17.2 66.93,64.48 | 66.93,64.48 68.4,64.48 D19.1 | SV4.2 66.8,64.35 66.93,64.48
MISO  (via drill 0.35)
  Top 0.508: v65.53,17.77 64.14,17.77 U69.31 62.62,17.88 v62.61,17.89
  Bottom 0.508: JP1.3 66.58,39.9 66.17,39.48 66.17,18.47 65.53,17.83 v65.53,17.77 | v62.61,17.89 61.09,17.89 59.82,19.16 59.82,34.66 57.91,36.56 49.02,36.56 47.7,35.24 U$2.P8
MOSI  (via drill 0.35)
  Top 0.508: JP1.2 64.1,37.36 v62.61,38.85 | v62.74,20.94 63.97,20.94 U69.29
  Bottom 0.508: v62.74,20.94 62.54,21.14 62.54,35.51 | 62.54,35.51 59.19,38.87 54.61,38.87 U$2.P5 | v62.61,38.85 62.61,35.58 62.54,35.51
N$1  (via drill 0.35)
  Top 0.15: v94,17 82.5,17 82,16.5 U69.11 | S3.1 39,69 39,75 S3.2
  Bottom 0.15: v94,17 97,20 97,59.5 93.5,63 93.5,80.5 85,89 39.5,89 39.5,75.5 S3.2
N$2
  Top 0.61: Q6.3 72.61,76.56 R25.1 69.87,76.46 Q3.3
N$3
  Top 1.016: D12.1 15.02,19.6 L2.1 19.34,17.06 22.38,20.1 IC1.2
N$5
  Top 0.381: Q2.1 51.46,14.98 49.3,12.83 R3.2
N$6
  Top 0.381: R4.2 51.13,21.2 Q4.1
N$7
  Top 0.61: Q6.5 75.89,81.43 82.3,75.02 82.3,68.13 C7.2
  Top 0.813: SENSOR_LEFT.3 17.27,82.67 C1.2
  Top 1.016: SENSOR_FRONT.3 61.7,85.68 C6.2 61.72,83.12 61.72,82.38 | C7.2 84.84,68.09 SENSOR_RIGHT.3 | C1.2 20.12,83 22,81.11 61.72,81.11 61.72,82.38 | 61.72,82.38 Q6.1
  pour Top (no thermals): 72.01,81.14 75.57,81.14 75.57,83.04 72.01,83.04
N$8
  Top 0.381: R21.1 D6.A
N$13  (via drill 0.35)
  Top 0.508: U6.3 12.8,38.97 10.67,38.97 10.43,39.21 v10.43,40.21
  Bottom 0.508: v10.43,40.21 9.4,40.21 8.38,39.19 R6.2 R5.1
N$22
  Top 0.381: R26.1 D7.A
N$23  (via drill 0.35)
  Top 0.15: v95.76,5.32 97.03,5.32 D2.A
  Bottom 0.15: v95.76,5.32 97.03,5.32 R1.2
N$25  (via drill 0.35)
  Top 0.15: v92.58,5.32 93.86,5.32 D3.A
  Bottom 0.15: v92.58,5.32 93.86,5.32 R18.2
N$26  (via drill 0.35)
  Top 0.15: v89.41,5.32 90.68,5.32 D4.A
  Bottom 0.15: v89.41,5.32 90.68,5.32 R19.2
N$28  (via drill 0.35)
  Top 0.15: v86.23,5.32 87.5,5.32 D5.A
  Bottom 0.15: v86.23,5.32 87.5,5.32 R20.2
RTS  (via drill 0.35)
  Top 0.381: R4.1 48.8,18.8 v48.8,16.32 | v50.45,12.89 51.57,12.89 Q2.2 | v44.74,19.36 44.87,19.24 U2.14
  Top 0.508: U2.14 49.24,19.24 R4.1
  Bottom 0.381: v48.8,16.32 48.8,14.54 v50.45,12.89
  Bottom 0.406: JP4.1 36.99,25.33 38.77,25.33 v44.74,19.36
SENSOR_EN
  Top 0.508: Q3.1 66.77,76.51 65.69,76.51 65.03,75.84 65.03,75 71.88,68.14 71.88,64.5 73.41,62.98 75.57,62.98 79.5,59.04 79.5,28.44 82.78,25.16 82.78,23.22 82.48,22.93 82.06,22.93 U69.15
SENSOR_FRONT
  Top 1.016: SENSOR_FRONT.1 56.91,88.65 57.33,89.06 81.36,89.06 90.81,79.61 90.81,43.17 90.68,43.04 90.68,23.99 86.08,19.38 U69.13
SENSOR_LEFT
  Top 1.016: SENSOR_LEFT.1 15.41,87.75 25.96,98.3 86.11,98.3 98.55,85.85 98.55,26.4 90.04,17.88 U69.12
SENSOR_RIGHT  (via drill 0.6)
  Top 0.61: v83.69,22.34 82.24,20.88 U69.14
  Bottom 0.61: SENSOR_RIGHT.1 85.03,23.67 v83.69,22.34
USB_VBUS  (via drill 0.5, 0.6)
  Top 0.508: IC1.4 26.1,23.5 R2.2 27.85,23.96 v28.45,23.35 | 36,7.93 32.26,11.67 v32.26,13.83
  Top 1.016: J1.1 36,7.93 22.03,7.93 21.08,8.88 16,8.88 3.05,21.83 3.05,39.61 v4.32,40.88
  Bottom 0.508: v28.45,23.35 32.26,19.54 v32.26,13.83 | 6.86,40.88 7.02,41.04
  Bottom 1.016: 6.86,40.88 v4.32,40.88 | 7.02,41.04 7.97,41.99 Q7.1 | J1.1 41.94,10.28 D1.2
  pour Bottom (rank 2): 6.86,45.96 6.86,42.15 11.3,42.15 11.3,45.96
VBAT  (via drill 0.35, 0.5, 0.6, 1.02)
  Top 0.508: R16.2 53.85,9.77 46.23,9.77 46.23,5.95 41.15,0.88 9.4,0.88 9.4,4.05 U$4.P+
  Top 1.016: 15.62,33.57 C12.1 | CR1.6 v38.99,56.17 38.99,56.14 34.52,51.67 v34.04,51.67 | IC1.1 19.66,23.5 19.57,23.41
  Top 1.27: v58.42,64.5 v61.85,64.5
  Top 2.032: v13.21,33.26 13.52,33.57 14.61,33.57 | 14.61,33.57 15.62,33.57 | 14.61,33.57 18.04,30.14 18.04,23.41 19.57,23.41
  Bottom 0.508: C9.1 41.5,56.5 41.5,56.17
  Bottom 1.016: U$4.P+ 9.4,4.5 | v34.04,51.67 34.29,51.42 | R5.2 5.84,33.01 9.4,29.45
  Bottom 1.27: v58.42,64.5 52.96,64.5 44.62,56.17 41.5,56.17 v38.99,56.17 | D16.1 63.8,56.08 63.68,56.21 D17.1 63.65,64.5 v61.85,64.5 | v34.04,51.67 34.04,51.69 30.91,54.82 30.91,55.25 D8.1 28.93,55.48 27.01,57.4 27.01,61.22 29.53,63.74 YRMOM.1
  Bottom 2.032: 34.29,51.42 34.29,42.73 28.56,37 22.5,37 18.76,33.26 v13.21,33.26 9.4,29.45 9.4,4.5
VSENSE_BAT
  Top 0.15: 53.85,7.86 56.39,7.86 R17.2 | 53.85,7.86 51.31,5.32 51.31,0.49 82.93,0.49 84.33,1.89 84.33,11.92 81.66,11.92 U69.8 | 53.85,7.86 R16.1
  Top 0.381: C18.1 R17.2

### Text on the board
tPlace: ATTACK | FLASH | RES | WAXN22 V8
tNames: IMU SOCKET